# EAGLE schematic openTPM-v20 (EAGLE 8.0.0)
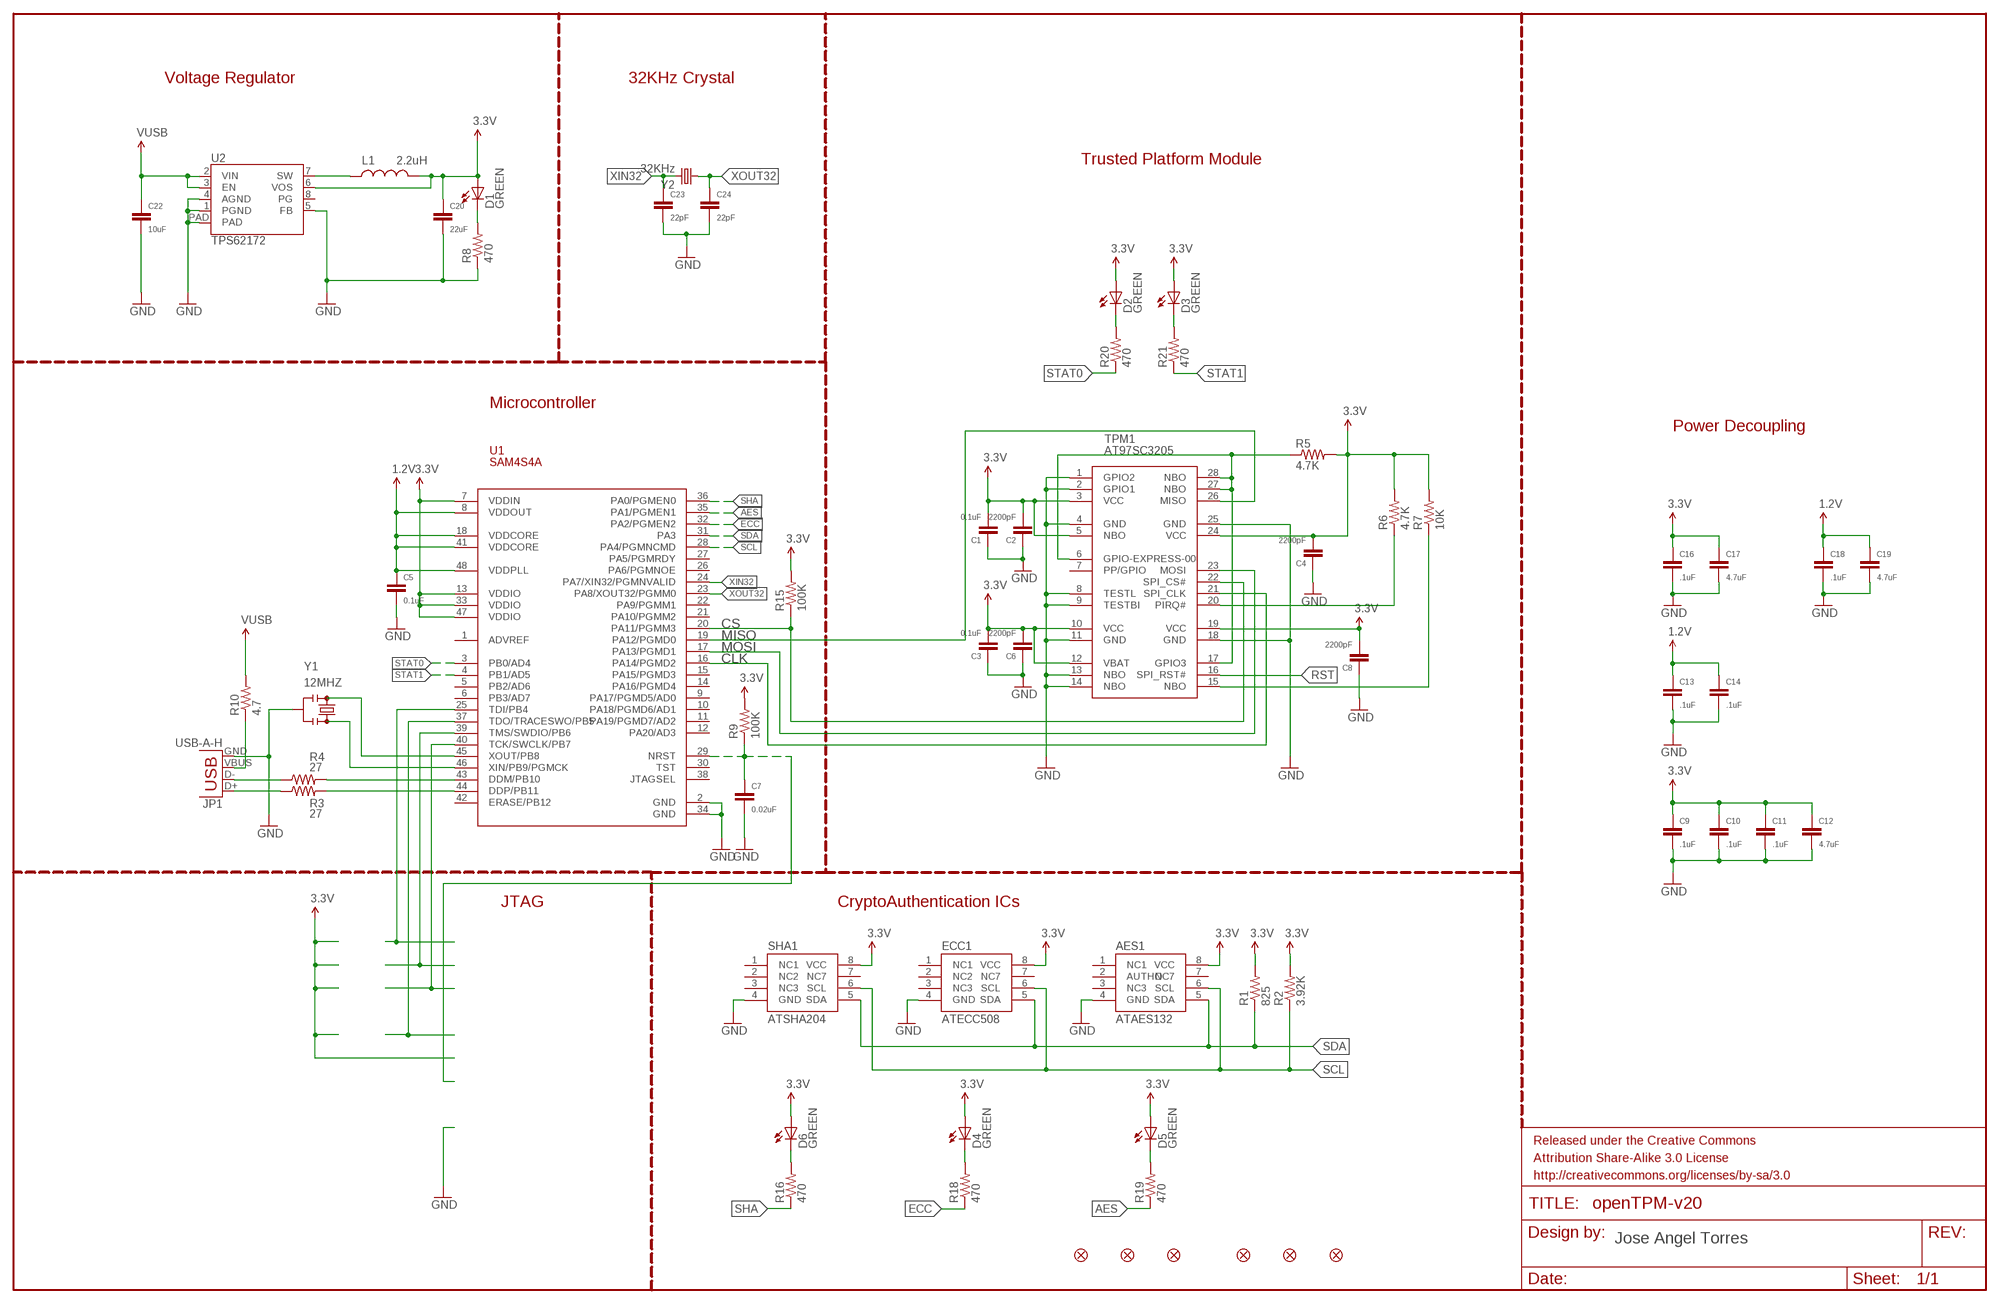
[diagram p0: schematic, sheet 1]

## Parts
AES1  ATAES132  CRYPTOTRONIX_ATAES132  [CRYPTOTRONIX_SOIC8]
C1  0.1uF  CAPACITOR.0402  [0402]
C2  2200pF  CAPACITOR.0402  [0402]
C3  0.1uF  CAPACITOR.0402  [0402]
C4  2200pF  CAPACITOR.0402  [0402]
C5  0.1uF  CAPACITOR.0402  [0402]
C6  2200pF  CAPACITOR.0402  [0402]
C7  0.02uF  CAPACITOR.0402  [0402]
C8  2200pF  CAPACITOR.0402  [0402]
C9  .1uF  CAPACITOR.0402  [0402]
C10  .1uF  CAPACITOR.0402  [0402]
C11  .1uF  CAPACITOR.0402  [0402]
C12  4.7uF  CAPACITOR.0402  [0402]
C13  .1uF  CAPACITOR.0402  [0402]
C14  .1uF  CAPACITOR.0402  [0402]
C16  .1uF  CAPACITOR.0402  [0402]
C17  4.7uF  CAPACITOR.0402  [0402]
C18  .1uF  CAPACITOR.0402  [0402]
C19  4.7uF  CAPACITOR.0402  [0402]
C20  22uF  CAPACITOR.0603  [0603]
C22  10uF  CAPACITOR.0402  [0402]
C23  22pF  CAPACITOR.0402  [0402]
C24  22pF  CAPACITOR.0402  [0402]
D1  GREEN  SPARKFUN-LED_LED-GREEN0603  [SPARKFUN-LED_LED-0603]
D2  GREEN  SPARKFUN-LED_LED-GREEN0603  [SPARKFUN-LED_LED-0603]
D3  GREEN  SPARKFUN-LED_LED-GREEN0603  [SPARKFUN-LED_LED-0603]
D4  GREEN  SPARKFUN-LED_LED-GREEN0603  [SPARKFUN-LED_LED-0603]
D5  GREEN  SPARKFUN-LED_LED-GREEN0603  [SPARKFUN-LED_LED-0603]
D6  GREEN  SPARKFUN-LED_LED-GREEN0603  [SPARKFUN-LED_LED-0603]
ECC1  ATECC508  [CRYPTOTRONIX_SOIC8]
FID1  SPARKFUN-AESTHETICS_FIDUCIAL1X2  [SPARKFUN-AESTHETICS_FIDUCIAL-1X2]
FID2  SPARKFUN-AESTHETICS_FIDUCIAL1X2  [SPARKFUN-AESTHETICS_FIDUCIAL-1X2]
FID3  SPARKFUN-AESTHETICS_FIDUCIAL1X2  [SPARKFUN-AESTHETICS_FIDUCIAL-1X2]
FID4  SPARKFUN-AESTHETICS_FIDUCIAL1X2  [SPARKFUN-AESTHETICS_FIDUCIAL-1X2]
FID5  SPARKFUN-AESTHETICS_FIDUCIAL1X2  [SPARKFUN-AESTHETICS_FIDUCIAL-1X2]
FID6  SPARKFUN-AESTHETICS_FIDUCIAL1X2  [SPARKFUN-AESTHETICS_FIDUCIAL-1X2]
JP1  USB-A-H  [USB-A-H]
L1  2.2uH  INDUCTOR0402  [C0402]
R1  825  RESISTOR.0402  [0402]
R2  3.92K  RESISTOR.0402  [0402]
R3  27  RESISTOR.0402  [0402]
R4  27  RESISTOR.0402  [0402]
R5  4.7K  RESISTOR.0402  [0402]
R6  4.7K  RESISTOR.0402  [0402]
R7  10K  RESISTOR.0402  [0402]
R8  470  RESISTOR.0402  [0402]
R9  100K  RESISTOR.0402  [0402]
R10  4.7  RESISTOR.0402  [0402]
R15  100K  RESISTOR.0402  [0402]
R16  470  RESISTOR.0402  [0402]
R18  470  RESISTOR.0402  [0402]
R19  470  RESISTOR.0402  [0402]
R20  470  RESISTOR.0402  [0402]
R21  470  RESISTOR.0402  [0402]
SHA1  ATSHA204  CRYPTOTRONIX_ATSHA204  [CRYPTOTRONIX_SOIC8]
TPM1  AT97SC3205  [TSSOP28]
U1  SAM4S4A  [LQFP-48]
U2  TPS62172  [WSON-8-PAD]
Y1  12MHZ  RESONATOR12MHZ  [RESONATOR-SMD]
Y2  32KHz  CRYSTALEPSONMC146  [CRYSTAL-32KHZ-SMD_EPSON_MC146]

## Nets
1.2V: C5.1 C13.1 C14.1 C18.1 C19.1 U1.8(VDDOUT) U1.18(VDDCORE) U1.41(VDDCORE) U1.48(VDDPLL)
3.3V: AES1.8(VCC) C1.2 C2.2 C3.2 C4.2 C6.2 C8.2 C9.1 C10.1 C11.1 C12.1 C16.1 C17.1 C20.1 D1.A D2.A D3.A D4.A D5.A D6.A ECC1.8(VCC) L1.2 R1.2 R2.2 R5.2 R6.2 R7.2 R9.2 R15.2 SHA1.8(VCC) TPM1.3(VCC) TPM1.5(NBO) TPM1.10(VCC) TPM1.12(VBAT) TPM1.19(VCC) TPM1.24(VCC) U1.7(VDDIN) U1.13(VDDIO) U1.33(VDDIO) U1.47(VDDIO) U2.6(VOS)
AES: R19.1 U1.35(PA1/PGMEN1)
CLK: TPM1.21(SPI_CLK) U1.16(PA14/PGMD2)
CS: R15.1 TPM1.22(SPI_CS#) U1.20(PA11/PGMM3)
ECC: R18.1 U1.32(PA2/PGMEN2)
GND: AES1.4(GND) C1.1 C2.1 C3.1 C4.1 C5.2 C6.1 C7.2 C8.1 C9.2 C10.2 C11.2 C12.2 C13.2 C14.2 C16.2 C17.2 C18.2 C19.2 C20.2 C22.2 C23.2 C24.2 ECC1.4(GND) JP1.GND R8.1 SHA1.4(GND) TPM1.1(GPIO2) TPM1.2(GPIO1) TPM1.4(GND) TPM1.8(TESTL) TPM1.9(TESTBI) TPM1.11(GND) TPM1.13(NBO) TPM1.14(NBO) TPM1.18(GND) TPM1.25(GND) U1.2(GND) U1.34(GND) U2.1(PGND) U2.4(AGND) U2.5(FB) U2.PAD Y1.2
MISO: TPM1.26(MISO) U1.19(PA12/PGMD0)
MOSI: TPM1.23(MOSI) U1.17(PA13/PGMD1)
N$1: R4.2 U1.43(DDM/PB10)
N$2: R3.2 U1.44(DDP/PB11)
N$3: U1.25(TDI/PB4)
N$4: U1.37(TDO/TRACESWO/PB5)
N$5: U1.39(TMS/SWDIO/PB6)
N$6: U1.40(TCK/SWCLK/PB7)
N$8: U1.45(XOUT/PB8) Y1.1
N$9: U1.46(XIN/PB9/PGMCK) Y1.3
N$10: R6.1 TPM1.20(PIRQ#)
N$11: JP1.D- R4.1
N$12: JP1.D+ R3.1
N$13: JP1.VBUS R10.1
N$14: R7.1 TPM1.15(NBO)
N$15: R5.1 TPM1.6(GPIO-EXPRESS-00) TPM1.17(GPIO3) TPM1.27(NBO) TPM1.28(NBO)
N$16: D4.C R18.2
N$17: L1.1 U2.7(SW)
N$18: D1.C R8.2
N$20: D6.C R16.2
N$21: D5.C R19.2
N$22: D2.C R20.2
N$23: D3.C R21.2
RST: C7.1 R9.1 TPM1.16(SPI_RST#) U1.29(NRST)
SCL: AES1.6(SCL) ECC1.6(SCL) R2.1 SHA1.6(SCL) U1.28(PA4/PGMNCMD)
SDA: AES1.5(SDA) ECC1.5(SDA) R1.1 SHA1.5(SDA) U1.31(PA3)
SHA: R16.1 U1.36(PA0/PGMEN0)
STAT0: R20.1 U1.3(PB0/AD4)
STAT1: R21.1 U1.4(PB1/AD5)
VUSB: C22.1 R10.2 U2.2(VIN) U2.3(EN)
XIN32: C23.1 U1.24(PA7/XIN32/PGMNVALID) Y2.P$1
XOUT32: C24.1 U1.23(PA8/XOUT32/PGMM0) Y2.P$2
Unconnected: AES1.1(NC1) AES1.2(AUTHO) AES1.3(NC3) AES1.7(NC7) ECC1.1(NC1) ECC1.2(NC2) ECC1.3(NC3) ECC1.7(NC7) SHA1.1(NC1) SHA1.2(NC2) SHA1.3(NC3) SHA1.7(NC7) TPM1.7(PP/GPIO) U1.1(ADVREF) U1.5(PB2/AD6) U1.6(PB3/AD7) U1.9(PA17/PGMD5/AD0) U1.10(PA18/PGMD6/AD1) U1.11(PA19/PGMD7/AD2) U1.12(PA20/AD3) U1.14(PA16/PGMD4) U1.15(PA15/PGMD3) U1.21(PA10/PGMM2) U1.22(PA9/PGMM1) U1.26(PA6/PGMNOE) U1.27(PA5/PGMRDY) U1.30(TST) U1.38(JTAGSEL) U1.42(ERASE/PB12) U2.8(PG)

## Notes on the sheet
- Voltage Regulator | 32KHz Crystal
- Trusted Platform Module
- Microcontroller
- Power Decoupling
- JTAG | CryptoAuthentication ICs
- Jose Angel Torres

## Library data of the parts
AES1 = TPM:CRYPTOTRONIX_ATAES132: 32Kb Serial EEPROM. AES-128-CCM. MAC. Secure Storage for 128-bit keys. Encrypted User Memory Readn and Write. HWRNG. 2.5V to 5.5V.
C1-C14 C16-C20 C22-C24 = TPM:CAPACITOR
D1-D6 = TPM:SPARKFUN-LED_LED-GREEN: Various green LEDs 0603- DIO-00821 LARGE- DIO-00862 LILYPAD- DIO-09910; PROD_ID: DIO-00821
ECC1 = TPM:ATECC508: ATECC108: Provides ECDSA with NIST curves P256, B283, and K283. Also, a RNG, 8.5Kb EEPROM. 2.0V - 5.5V.
FID1-FID6 = TPM:SPARKFUN-AESTHETICS_FIDUCIAL: Fiducial Alignment Points Various fiducial points for machine vision alignment.
JP1 = TPM:USB: USB Connectors USB-B-PTH is fully proven SKU : PRT-00139/CONN-08278 USB-miniB is fully proven SKU : PRT-00587 USB-A-PCB is untested. USB-A-H is throughly reviewed, but untested. Spark Fun Electronics SKU : PRT-00437 USB-B-SMT is throughly reviewed, but untested. Needs silkscreen touching up. USB-A-S has not been used/tested USB-MB-H has not been used/tested USB-MICROB has been used. CONN-09505; PROD_ID: CONN-08367
L1 = TPM:INDUCTOR: Inductors Basic Inductor/Choke - 0603 and 1206. Footprints are not proven and vary greatly between part numbers. INDUCTOR POWER 3.3UH 4.0A SMD 0.197" L x 0.197" W x 0.177" H (5.00mm x 5.00mm x 4.50mm)
R1-R10 R15 R16 R18-R21 = TPM:RESISTOR
SHA1 = TPM:CRYPTOTRONIX_ATSHA204: ATSHA204
TPM1 = TPM:AT97SC3205: Atmel TPM 1.2
U1 = TPM:SAM4S4A
U2 = TPM:TPS62172: Texas Instruments TPS62172 3-17V 0.5A Step-Down Converter with DCS control. Available in adjustable and fixed output voltage versions. Is packaged in an 8-pin WSON package measuring 2 × 2 mm (DSG). See a 3.3V fixed output version of this chip in action on the Electric Imp Breakout Board <https://www.sparkfun.com/products/11400>. Datasheet <http://www.ti.com/lit/gpn/tps62172>; PROD_ID: IC-11307
Y1 = TPM:RESONATOR: Resonator Small SMD resonator. Used, eg, on the Arduino Pro/ Pro Mini boards. 8MHz- XTAL-08895 16MHz- XTAL-08900; PROD_ID: XTAL-08900; VALUE: 16MHZ
Y2 = TPM:CRYSTAL: Various standard crystals. Proven footprints.